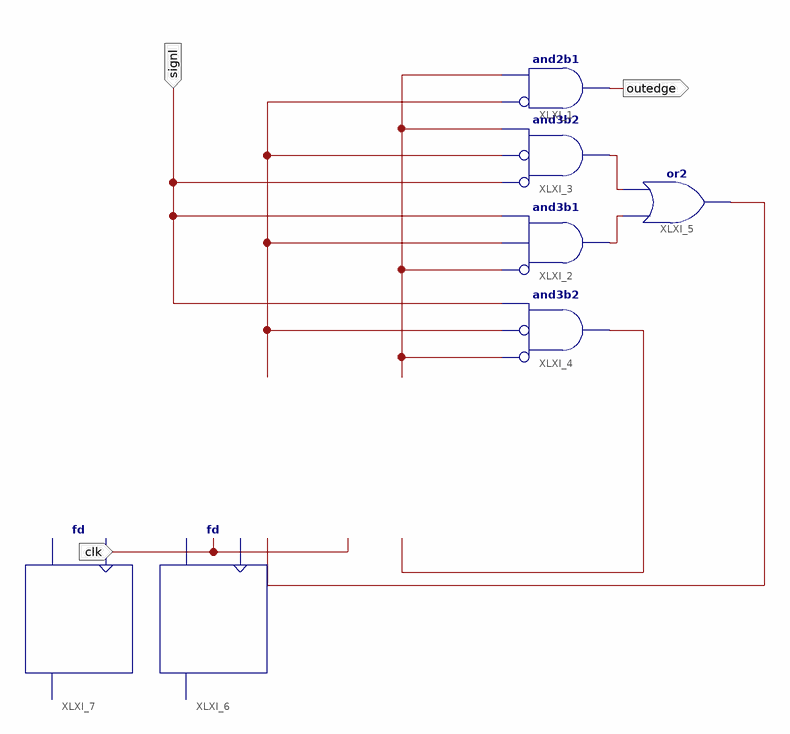
[diagram p0: schematic sheet 1]
// Xilinx ISE schematic rising_edge_detector_sch.sch (spartan3e) as structural Verilog: 7 symbols, 3 ports
module rising_edge_detector_sch (
  input  signl,
  input  clk,
  output outedge
);

  wire XLXN_1, XLXN_2, XLXN_29, XLXN_30, XLXN_32, XLXN_33;

  fd XLXI_6 (.C(clk), .D(XLXN_32), .Q(XLXN_30));
  fd XLXI_7 (.C(clk), .D(XLXN_33), .Q(XLXN_29));
  and XLXI_1 (outedge, ~XLXN_29, XLXN_30);  // and2b1
  and XLXI_2 (XLXN_2, ~XLXN_30, XLXN_29, signl);  // and3b1
  and XLXI_3 (XLXN_1, ~signl, ~XLXN_29, XLXN_30);  // and3b2
  and XLXI_4 (XLXN_32, ~XLXN_30, ~XLXN_29, signl);  // and3b2
  or XLXI_5 (XLXN_33, XLXN_2, XLXN_1);
endmodule
